# EAGLE design untitled (EAGLE 7.6.0)
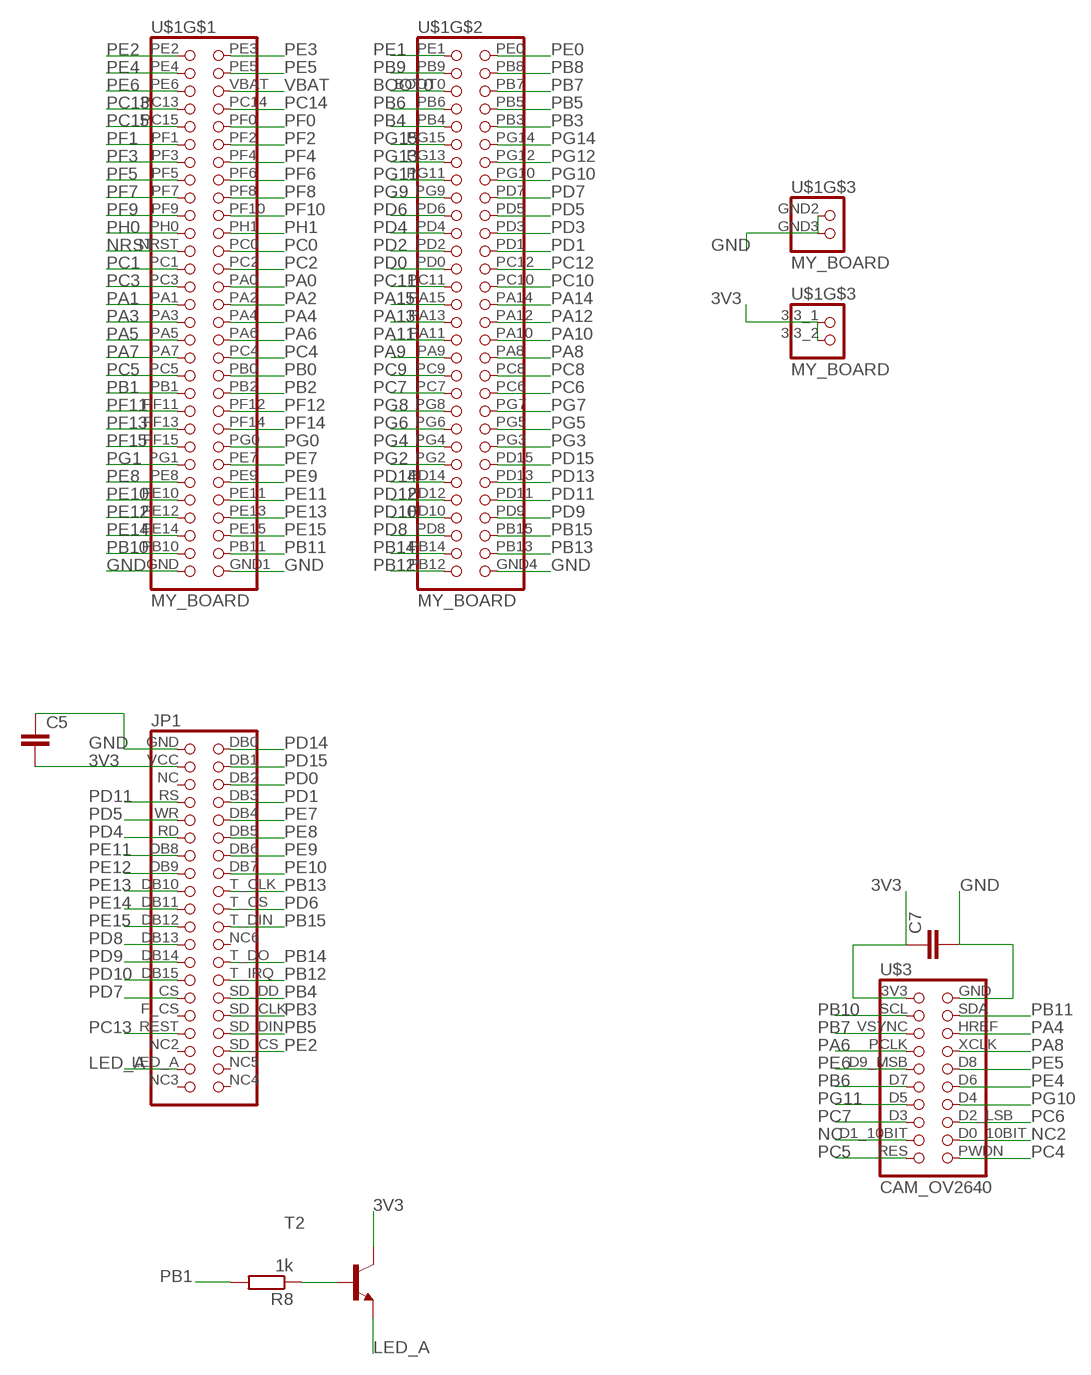
[diagram p0: schematic, sheet 1]

## Parts
C5  C-EUC1206  [C1206]
C7  C-EUC1206  [C1206]
JP1  LCD320QVBLCD320QVB  [2X20]
R8  1k  R-EU_R1206  [R1206]
T2  BC817-16-NPN-SOT23-BEC  [SOT23-BEC]
U$1  MY_BOARD  [MY_BOARD]
U$3  CAM_OV2640  [CAM_OV2640]

## Nets
3V3: C5.2 C7.1 JP1.VCC T2.C U$1.3,3_1 U$1.3,3_2 U$3.3V3
BOOT0: U$1.BOOT0
GND: C5.1 C7.2 JP1.GND U$1.GND U$1.GND1 U$1.GND2 U$1.GND3 U$1.GND4 U$3.GND
LED_A: JP1.LED_A T2.E
N$9: R8.1 T2.B
NC: U$3.D1_10BIT
NC2: U$3.D0_10BIT
NRST: U$1.NRST
PA0: U$1.PA0
PA1: U$1.PA1
PA2: U$1.PA2
PA3: U$1.PA3
PA4: U$1.PA4 U$3.HREF
PA5: U$1.PA5
PA6: U$1.PA6 U$3.PCLK
PA7: U$1.PA7
PA8: U$1.PA8 U$3.XCLK
PA9: U$1.PA9
PA10: U$1.PA10
PA11: U$1.PA11
PA12: U$1.PA12
PA13: U$1.PA13
PA14: U$1.PA14
PA15: U$1.PA15
PB0: U$1.PB0
PB1: R8.2 U$1.PB1
PB2: U$1.PB2
PB3: JP1.SD_CLK U$1.PB3
PB4: JP1.SD_DD U$1.PB4
PB5: JP1.SD_DIN U$1.PB5
PB6: U$1.PB6 U$3.D7
PB7: U$1.PB7 U$3.VSYNC
PB8: U$1.PB8
PB9: U$1.PB9
PB10: U$1.PB10 U$3.SCL
PB11: U$1.PB11 U$3.SDA
PB12: JP1.T_IRQ U$1.PB12
PB13: JP1.T_CLK U$1.PB13
PB14: JP1.T_DO U$1.PB14
PB15: JP1.T_DIN U$1.PB15
PC0: U$1.PC0
PC1: U$1.PC1
PC2: U$1.PC2
PC3: U$1.PC3
PC4: U$1.PC4 U$3.PWDN
PC5: U$1.PC5 U$3.RES
PC6: U$1.PC6 U$3.D2_LSB
PC7: U$1.PC7 U$3.D3
PC8: U$1.PC8
PC9: U$1.PC9
PC10: U$1.PC10
PC11: U$1.PC11
PC12: U$1.PC12
PC13: JP1.REST U$1.PC13
PC14: U$1.PC14
PC15: U$1.PC15
PD0: JP1.DB2 U$1.PD0
PD1: JP1.DB3 U$1.PD1
PD2: U$1.PD2
PD3: U$1.PD3
PD4: JP1.RD U$1.PD4
PD5: JP1.WR U$1.PD5
PD6: JP1.T_CS U$1.PD6
PD7: JP1.CS U$1.PD7
PD8: JP1.DB13 U$1.PD8
PD9: JP1.DB14 U$1.PD9
PD10: JP1.DB15 U$1.PD10
PD11: JP1.RS U$1.PD11
PD12: U$1.PD12
PD13: U$1.PD13
PD14: JP1.DB0 U$1.PD14
PD15: JP1.DB1 U$1.PD15
PE0: U$1.PE0
PE1: U$1.PE1
PE2: JP1.SD_CS U$1.PE2
PE3: U$1.PE3
PE4: U$1.PE4 U$3.D6
PE5: U$1.PE5 U$3.D8
PE6: U$1.PE6 U$3.D9_MSB
PE7: JP1.DB4 U$1.PE7
PE8: JP1.DB5 U$1.PE8
PE9: JP1.DB6 U$1.PE9
PE10: JP1.DB7 U$1.PE10
PE11: JP1.DB8 U$1.PE11
PE12: JP1.DB9 U$1.PE12
PE13: JP1.DB10 U$1.PE13
PE14: JP1.DB11 U$1.PE14
PE15: JP1.DB12 U$1.PE15
PF0: U$1.PF0
PF1: U$1.PF1
PF2: U$1.PF2
PF3: U$1.PF3
PF4: U$1.PF4
PF5: U$1.PF5
PF6: U$1.PF6
PF7: U$1.PF7
PF8: U$1.PF8
PF9: U$1.PF9
PF10: U$1.PF10
PF11: U$1.PF11
PF12: U$1.PF12
PF13: U$1.PF13
PF14: U$1.PF14
PF15: U$1.PF15
PG0: U$1.PG0
PG1: U$1.PG1
PG2: U$1.PG2
PG3: U$1.PG3
PG4: U$1.PG4
PG5: U$1.PG5
PG6: U$1.PG6
PG7: U$1.PG7
PG8: U$1.PG8
PG9: U$1.PG9
PG10: U$1.PG10 U$3.D4
PG11: U$1.PG11 U$3.D5
PG12: U$1.PG12
PG13: U$1.PG13
PG14: U$1.PG14
PG15: U$1.PG15
PH0: U$1.PH0
PH1: U$1.PH1
VBAT: U$1.VBAT
Unconnected: JP1.F_CS JP1.NC JP1.NC2 JP1.NC3 JP1.NC4 JP1.NC5 JP1.NC6

## Library data of the parts
C5 C7 = resistor:C-EU: CAPACITOR, European symbol
JP1 = Stworzone:LCD320QVB: LCD320 QVB
R8 = rcl:R-EU_: RESISTOR, European symbol
T2 = transistor:*-NPN-: NPN Transistror BF959 corrected 2008.03.06
U$1 = Stworzone:MY_BOARD
U$3 = Stworzone:CAM_OV2640

## Board
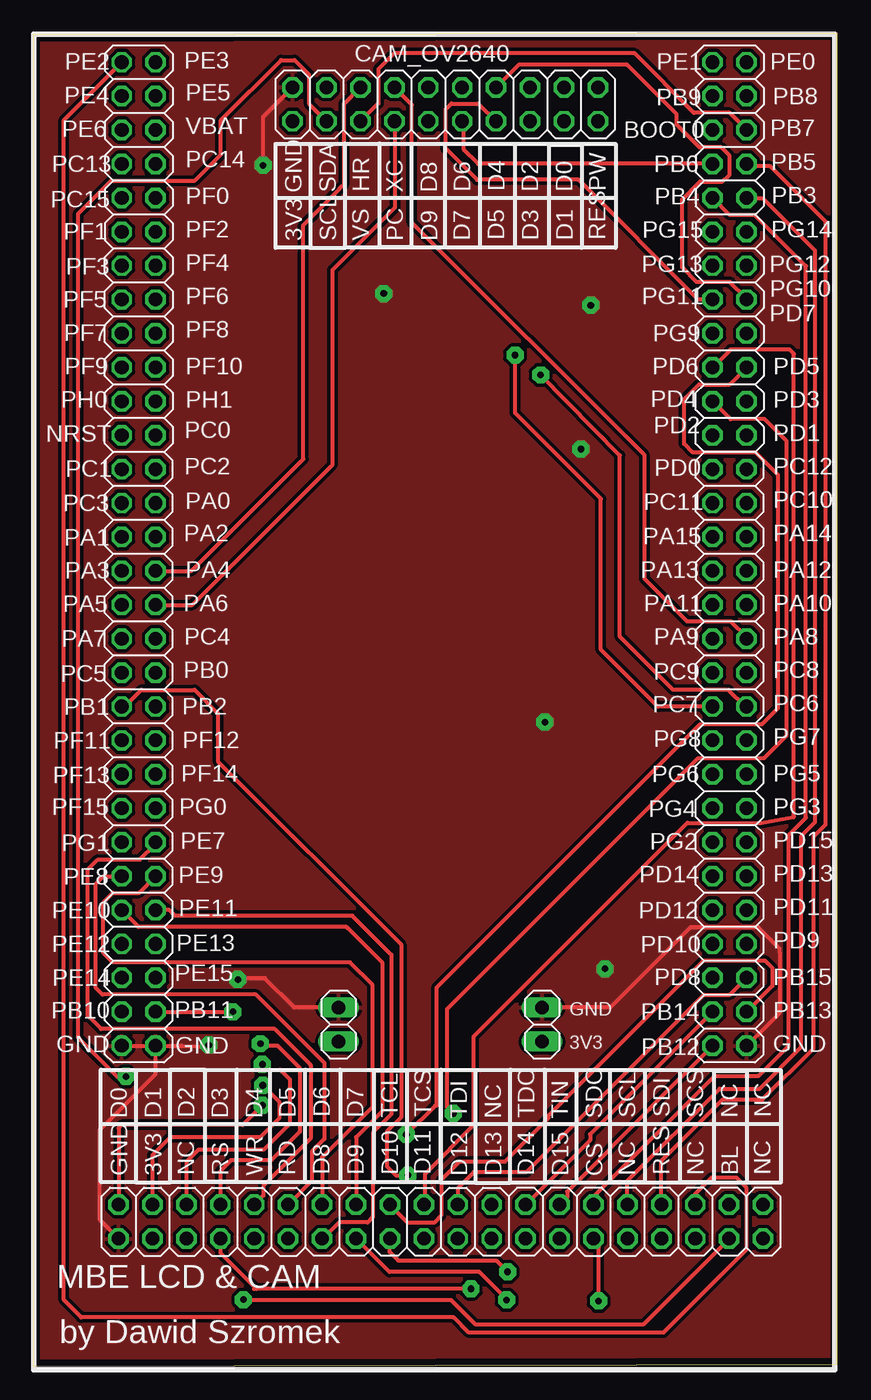
[diagram p1: board, top side]
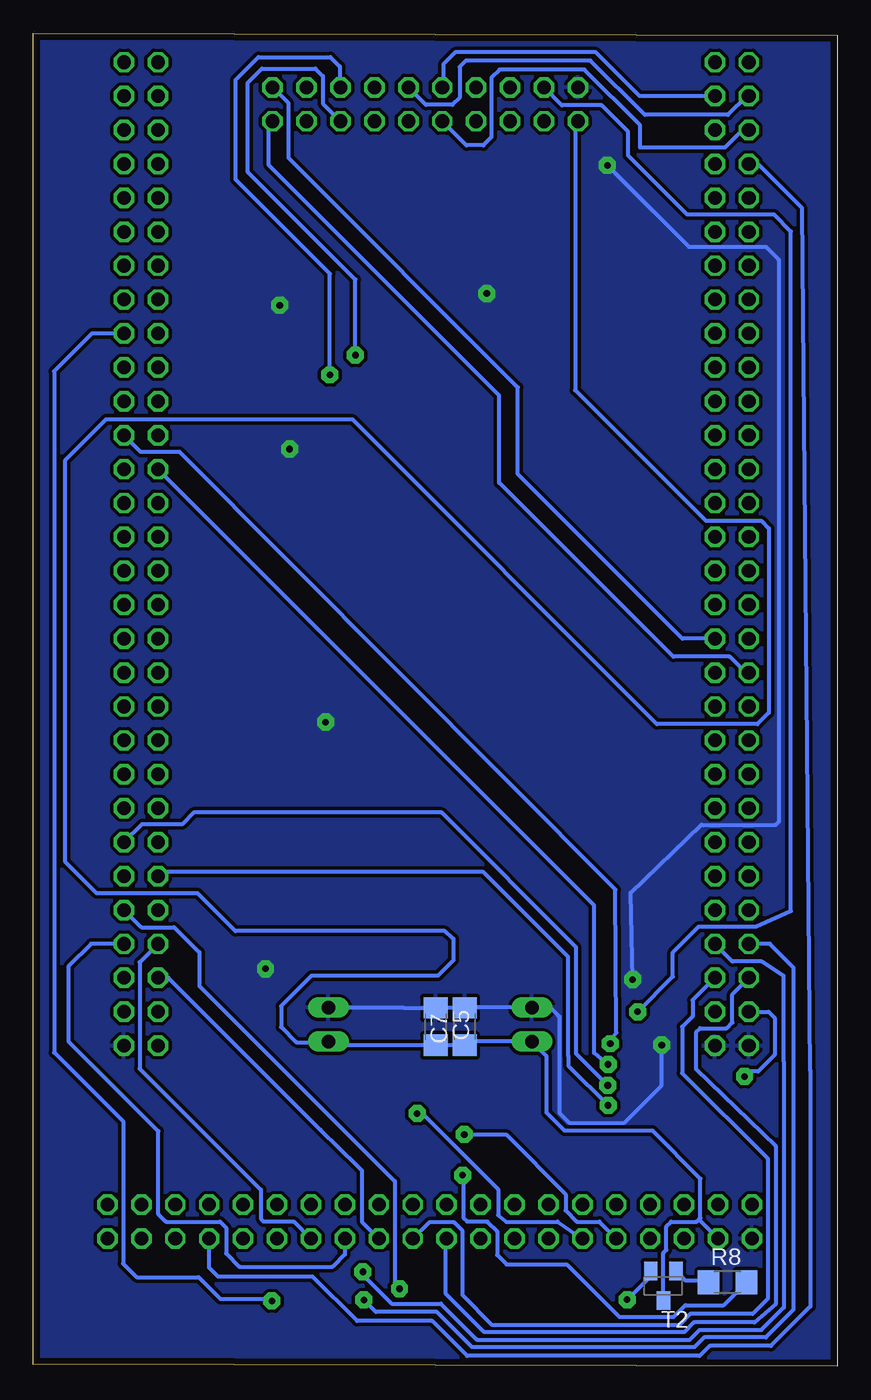
[diagram p2: board, bottom side, seen from below]

Size 60.18 x 99.82 mm. Coordinates in mm from the lower left corner, seen from the top.
Outline: 0,0 60.18,0.13 60.18,99.82 0,99.7 0,0
Copper layers (1*16): Top 0.035mm / dielectric 1.6mm / Bottom 0.035mm
Design rules "Elecrow_2-layer_PCB_eagle_rule": minimum track width 6mil, minimum drill 12mil, track to track 6mil, track to pad 6mil, pad to pad 6mil, via to via 8mil, smd to smd 0mil, copper to edge 20mil, drill to drill 10mil, minimum pad ring 6mil, minimum via ring 6mil, stop-mask expansion 0mil, vias tented up to drill 100mil, thermal gap 10mil

### Footprints (pad centres in the part's own frame; a part is rotated, then mirrored left to right if it is on the bottom)
C1206 = smd 1.6 x 1.8: 1 -1.4,0; 2 1.4,0
2X20 = drill 1.016 octagon: CS 11.43,-1.27; DB0 -24.13,1.27; DB1 -21.59,1.27; DB2 -19.05,1.27; DB3 -16.51,1.27; DB4 -13.97,1.27; DB5 -11.43,1.27; DB6 -8.89,1.27; DB7 -6.35,1.27; DB8 -8.89,-1.27; DB9 -6.35,-1.27; DB10 -3.81,-1.27; DB11 -1.27,-1.27; DB12 1.27,-1.27; DB13 3.81,-1.27; DB14 6.35,-1.27; DB15 8.89,-1.27; F_CS 13.97,-1.27; GND -24.13,-1.27; LED_A 21.59,-1.27; NC -19.05,-1.27; NC2 19.05,-1.27; NC3 24.13,-1.27; NC4 24.13,1.27; NC5 21.59,1.27; NC6 3.81,1.27; RD -11.43,-1.27; REST 16.51,-1.27; RS -16.51,-1.27; SD_CLK 13.97,1.27; SD_CS 19.05,1.27; SD_DD 11.43,1.27; SD_DIN 16.51,1.27; T_CLK -3.81,1.27; T_CS -1.27,1.27; T_DIN 1.27,1.27; T_DO 6.35,1.27; T_IRQ 8.89,1.27; VCC -21.59,-1.27; WR -13.97,-1.27
R1206 = smd 1.6 x 1.803: 1 -1.422,0; 2 1.422,0
SOT23-BEC = smd 1 x 1.4: B -0.95,-1.1; C 0,1.1; E 0.95,-1.1
MY_BOARD = drill 1.016 long: 3,3_1 12.34,-5.43; 3,3_2 27.57,-5.43; GND2 12.34,-2.89; GND3 27.57,-2.89 | drill 1.016 octagon: BOOT0 40.34,62.84; GND -3.9,-5.74; GND1 -1.36,-5.74; GND4 42.88,-5.74; NRST -3.9,39.98; PA0 -1.36,34.9; PA1 -3.9,32.36; PA2 -1.36,32.36; PA3 -3.9,29.82; PA4 -1.36,29.82; PA5 -3.9,27.28; PA6 -1.36,27.28; PA7 -3.9,24.74; PA8 42.88,24.74; PA9 40.34,24.74; PA10 42.88,27.28; PA11 40.34,27.28; PA12 42.88,29.82; PA13 40.34,29.82; PA14 42.88,32.36; PA15 40.34,32.36; PB0 -1.36,22.2; PB1 -3.9,19.66; PB2 -1.36,19.66; PB3 42.88,57.76; PB4 40.34,57.76; PB5 42.88,60.3; PB6 40.34,60.3; PB7 42.88,62.84; PB8 42.88,65.38; PB9 40.34,65.38; PB10 -3.9,-3.2; PB11 -1.36,-3.2; PB12 40.34,-5.74; PB13 42.88,-3.2; PB14 40.34,-3.2; PB15 42.88,-0.66; PC0 -1.36,39.98; PC1 -3.9,37.44; PC2 -1.36,37.44; PC3 -3.9,34.9; PC4 -1.36,24.74; PC5 -3.9,22.2; PC6 42.88,19.66; PC7 40.34,19.66; PC8 42.88,22.2; PC9 40.34,22.2; PC10 42.88,34.9; PC11 40.34,34.9; PC12 42.88,37.44; PC13 -3.9,60.3; PC14 -1.36,60.3; PC15 -3.9,57.76; PD0 40.34,37.44; PD1 42.88,39.98; PD2 40.34,39.98; PD3 42.88,42.52; PD4 40.34,42.52; PD5 42.88,45.06; PD6 40.34,45.06; PD7 42.88,47.6; PD8 40.34,-0.66; PD9 42.88,1.88; PD10 40.34,1.88; PD11 42.88,4.42; PD12 40.34,4.42; PD13 42.88,6.96; PD14 40.34,6.96; PD15 42.88,9.5; PE0 42.88,67.92; PE1 40.34,67.92; PE2 -3.9,67.92; PE3 -1.36,67.92; PE4 -3.9,65.38; PE5 -1.36,65.38; PE6 -3.9,62.84; PE7 -1.36,9.5; PE8 -3.9,6.96; PE9 -1.36,6.96; PE10 -3.9,4.42; PE11 -1.36,4.42; PE12 -3.9,1.88; PE13 -1.36,1.88; PE14 -3.9,-0.66; PE15 -1.36,-0.66; PF0 -1.36,57.76; PF1 -3.9,55.22; PF2 -1.36,55.22; PF3 -3.9,52.68; PF4 -1.36,52.68; PF5 -3.9,50.14; PF6 -1.36,50.14; PF7 -3.9,47.6; PF8 -1.36,47.6; PF9 -3.9,45.06; PF10 -1.36,45.06; PF11 -3.9,17.12; PF12 -1.36,17.12; PF13 -3.9,14.58; PF14 -1.36,14.58; PF15 -3.9,12.04; PG0 -1.36,12.04; PG1 -3.9,9.5; PG2 40.34,9.5; PG3 42.88,12.04; PG4 40.34,12.04; PG5 42.88,14.58; PG6 40.34,14.58; PG7 42.88,17.12; PG8 40.34,17.12; PG9 40.34,47.6; PG10 42.88,50.14; PG11 40.34,50.14; PG12 42.88,52.68; PG13 40.34,52.68; PG14 42.88,55.22; PG15 40.34,55.22; PH0 -3.9,42.52; PH1 -1.36,42.52; VBAT -1.36,62.84
CAM_OV2640 = drill 1.016 octagon: 3V3 -1.27,11.43; D0_10BIT 1.27,-8.89; D1_10BIT -1.27,-8.89; D2_LSB 1.27,-6.35; D3 -1.27,-6.35; D4 1.27,-3.81; D5 -1.27,-3.81; D6 1.27,-1.27; D7 -1.27,-1.27; D8 1.27,1.27; D9_MSB -1.27,1.27; GND 1.27,11.43; HREF 1.27,6.35; PCLK -1.27,3.81; PWDN 1.27,-11.43; RES -1.27,-11.43; SCL -1.27,8.89; SDA 1.27,8.89; VSYNC -1.27,6.35; XCLK 1.27,3.81

### Placement (x,y rotation side)
C5  30.05,25.43 270 bottom
C7  27.9,25.43 90 bottom
JP1  30.51,10.82 0 top
R8  8.2,6.27 0 bottom
T2  13,6.02 180 bottom
U$1  10.52,29.74 0 top
U$3  30.84,94.51 90 top

### Tracks (layer width: path | path; a pad name or v marks a point on that pad's centre or on a via)
3V3
  Bottom 0.305: U$3.3V3 19.61,93.04 19.61,73.1 9.83,63.32 5.69,63.32 5.11,62.74 5.11,48.95 5.97,48.08 13.49,48.08 36.32,70.92 54.74,70.92 57.78,67.87 57.78,37.74 55.45,35.41 47.88,35.41 45.06,32.59 29.36,32.59 28.73,32 28.73,30.4 29.9,29.24 39.37,29.24 41.63,26.97 41.63,25.4 40.49,24.26 38.14,24.26 U$1.3,3_2 37.81,24.03 C5.2 C7.1 27.62,24.31 U$1.3,3_1 21.74,23.2 21.74,18.97 20.4,17.63 13.82,17.63 10.24,14.05 10.24,11.1 | 10.24,11.1 10.24,10.87 JP1.VCC 8.94,9.55 | T2.C 13,8.48 12.78,8.71 12.78,10.46 12.42,10.82 10.52,10.82 10.24,11.1
GND  (via drill 0.5 pad 1.27)
  Top 0.305: U$1.GND U$1.GND1 | U$1.GND1 11.08,24 13.2,23.92 13.2,24.02 v13.13,24.05 | v15.32,28.96 15.19,29.06 17.32,29.06 19.53,26.85 U$1.GND2 | v17.2,89.94 17.2,93.57 U$3.GND | JP1.GND 4.98,10.95 4.98,17.7 9.16,21.88 U$1.GND1 | U$1.GND4 55.91,26.51 55.91,30.96 55.88,30.99 55.88,31.27 54.28,32.87 49.2,32.87 43.19,26.85 U$1.GND3
  Bottom 0.305: U$1.GND3 32.48,26.85 32.46,26.83 C5.1 C7.2 27.88,26.85 U$1.GND2 21.47,26.85 20.88,26.26 | 20.9,26.26 20.88,26.26 | 20.88,26.26 20.8,26.19 20.8,18.97 20.07,18.24 15.93,18.24 13.13,21.03 v13.13,24.05 | v15.32,28.96 15.47,35.46 10.16,40.54 4.6,40.54 4.34,40.79 4.34,82.85 5.31,83.82 11.07,83.82 v17.2,89.94
  other vias: 26.24,80.34 41.73,79.45 41,68.68 38.3,48.23 42.8,29.77
  pour Bottom (isolate 0.254): 0.05,99.72 60.1,99.72 60.1,0.13 0.05,0.13
  pour Top (isolate 0.254): 0.03,99.72 60.1,99.72 60.1,0.13 0.03,0.13
LED_A  (via drill 0.5 pad 1.27)
  Top 0.305: v15.72,4.98 31.27,4.95 33.07,3.15 45.69,3.15 JP1.LED_A
  Bottom 0.305: v15.72,4.98 14.04,6.66 14.04,7.17 14.01,7.17 T2.E
N$9
  Bottom 0.305: R8.1 9.94,6.4 11.34,6.4 T2.B
PA4
  Top 0.305: U$1.PA4 11.84,59.56 20.22,67.95 20.22,85.47 22.94,88.19 22.94,88.21 23.06,88.34 23.09,88.34 23.27,88.52 23.27,94.56 U$3.HREF
PA6
  Top 0.305: U$1.PA6 11.89,57.02 22.4,67.54 22.4,82.12 27.08,86.79 27.08,93.19 U$3.PCLK
PA8
  Top 0.305: U$1.PA8 53.4,54.61 52.22,55.78 48.95,55.78 45.77,58.95 45.77,68.22 28.35,85.65 28.35,94.46 U$3.XCLK
PB1  (via drill 0.5 pad 1.27)
  Top 0.305: U$1.PB1 6.83,49.4 8.08,50.65 12.06,50.65 13.82,48.9 13.82,45.29 27.53,31.57 27.53,18.64 26.47,17.58 26.47,14.96 27.13,14.3 v28.04,14.3
  Bottom 0.305: v28.04,14.3 27.99,14.25 27.99,11.13 27.71,10.85 26.29,10.85 26.26,10.82 26.19,10.82 25.45,10.08 25.45,8.33 24.74,7.62 20.24,7.62 16.31,3.68 12.24,3.68 11.35,4.57 8.48,4.57 R8.2
PB3
  Top 0.305: JP1.SD_CLK 44.48,13.87 51.38,20.78 54.38,20.78 57.51,23.9 57.51,39.73 58.52,40.74 58.52,83.57 54.66,87.43 53.47,87.43 U$1.PB3
PB4
  Top 0.305: JP1.SD_DD 41.94,12.67 51,21.74 54.31,21.74 56.54,23.98 56.54,39.78 57.84,41.07 57.84,82.4 54.03,86.21 52.15,86.21 U$1.PB4
PB5
  Top 0.305: JP1.SD_DIN 47.02,15.37 51.61,19.96 54.58,19.96 58.42,23.8 58.42,39.67 59.31,40.56 59.31,85.73 55.17,89.87 53.57,89.87 U$1.PB5
PB6
  Top 0.305: U$1.PB6 33.3,90.04 32.23,91.11 32.23,93.12 U$3.D7
PB7
  Top 0.305: U$1.PB7 53.4,92.6 52.12,93.88 49.45,93.88 45.01,98.32 27,98.32 25.83,97.16 25.83,94.59 U$3.VSYNC
PB10  (via drill 0.5 pad 1.27)
  Top 0.305: v6.93,21.69 6.25,21.69 3.35,24.59 3.35,86.31 5.84,88.8 12.09,88.8 14.05,90.75 14.05,93.32 18.54,97.82 19.56,97.82 20.62,96.75 20.62,94.56 U$3.SCL
  Bottom 0.305: U$1.PB10 5.13,26.54 4.67,26.09 4.67,23.32 5.92,22.07 6.55,22.07 v6.93,21.69
PB11  (via drill 0.5 pad 1.27)
  Top 0.305: U$1.PB11 12.19,26.54 v14.94,26.54
  Bottom 0.305: v14.94,26.54 12.29,29.18 12.29,30.99 10.36,32.92 6.07,32.92 3.45,34.09 3.45,84.99 4.72,86.26 5.82,86.26 6.25,86.26 11.23,86.26 15.65,90.68 15.65,92.46 17.63,94.44 20.6,94.44 U$3.SDA
PB12
  Top 0.305: U$1.PB12 46.15,19.3 46.15,19.25 39.95,13.06 39.95,12.65 JP1.T_IRQ
PB13
  Top 0.305: U$1.PB13 55.32,28.47 55.32,29.82 54.76,30.38 50.19,30.38 38.56,18.75 38.56,18.57 35.31,15.32 31.9,15.32 30.53,13.94 30.53,11.28 30,10.74 28.04,10.74 JP1.T_CLK
PB14
  Top 0.305: U$1.PB14 41.69,17.37 41.69,16.92 JP1.T_DO
PB15
  Top 0.305: U$1.PB15 52.13,27.81 50.19,27.81 36.91,14.53 32.97,14.53 31.78,13.34 JP1.T_DIN
PC4
  Bottom 0.305: U$1.PC4 11.58,54.48 23.9,66.8 23.9,73.3 41.07,90.47 41.07,94.59 U$3.PWDN
PC5
  Bottom 0.305: U$1.PC5 6.86,51.94 8.05,53.14 12.27,53.14 25.3,66.17 25.3,72.69 42.54,89.94 42.54,92.96 U$3.RES
PC6  (via drill 0.5 pad 1.27)
  Top 0.305: U$1.PC6 53.29,49.4 52.04,50.65 47.9,50.65 43.92,54.64 43.92,68.2 v37.97,74.24
  Bottom 0.305: v37.97,74.24 37.97,81.81 45.03,88.87 45.03,96.34 43.33,98.04 37.95,98.04 37.24,97.33 37.24,95.83 U$3.D2_LSB
PC7  (via drill 0.5 pad 1.27)
  Top 0.305: U$1.PC7 46.76,49.4 42.49,53.67 42.49,64.97 36.07,71.4 v36.07,75.72
  Bottom 0.305: v36.07,75.72 36.07,81.38 44.12,89.43 44.12,96.14 43.08,97.18 39.07,97.18 38.51,96.62 38.51,94.56 U$3.D3
PC13
  Bottom 0.305: JP1.REST 47.02,7.37 46.35,6.71 39.27,6.71 35.94,3.38 30.33,3.38 27.71,0.76 10.29,0.76 9.52,1.52 4.95,1.52 2.01,4.47 2.01,22.12 2.62,86.73 5.93,90.04 U$1.PC13
PD0  (via drill 0.5 pad 1.27)
  Top 0.305: v17.14,22.61 17.45,22.89 17.07,22.61 17.48,22.2 18.47,22.2 19.2,21.46 19.2,18.16 17.25,16.21 12.34,16.21 11.46,15.32 JP1.DB2
  Bottom 0.305: v17.14,22.61 17.14,22.58 18.19,23.44 18.19,34.51 U$1.PD0
PD1  (via drill 0.5 pad 1.27)
  Top 0.305: v16.99,24.16 17.25,24 18.29,24 19.94,22.35 19.94,17.55 17.81,15.42 14.81,15.42 14,14.61 JP1.DB3
  Bottom 0.305: v16.99,24.16 16.99,24.33 16.54,24.97 16.61,35.69 49.23,68.48 52.15,68.48 U$1.PD1
PD4  (via drill 0.5 pad 1.27)
  Top 0.305: U$1.PD4 52.2,70.92 54.76,70.92 56.39,69.29 56.39,47.22 54.71,45.54 49.78,45.54 30.95,26.71 30.95,19.42 v31.45,18.92
  Bottom 0.305: JP1.RD 20.93,10.82 24.74,10.8 25.37,11.3 25.37,13.23 31.06,18.92 v31.45,18.92
PD5  (via drill 0.5 pad 1.27)
  Top 0.305: U$1.PD5 52.13,73.53 49.83,73.53 48.72,72.42 48.72,69.09 49.38,68.43 54.08,68.43 55.75,66.75 55.75,49.28 54.56,48.08 49.94,48.08 30.18,28.32 30.18,19.51 30.07,19.51 v27.91,17.35
  Bottom 0.305: v27.91,17.35 24.79,17.35 20.32,12.88 20.32,11.66 19.48,10.82 17.81,10.82 JP1.WR
PD6
  Top 0.305: U$1.PD6 52.2,76.15 56.62,76.15 56.95,75.82 56.95,41.15 54.46,40.69 48.97,40.69 32.95,24.67 32.95,18.02 29.31,14.38 29.31,12.17 JP1.T_CS
PD7  (via drill 0.5 pad 1.27)
  Top 0.305: v42.32,4.88 42.32,9.17 JP1.CS
  Bottom 0.305: U$1.PD7 55.8,77.34 58.62,74.52 58.62,23.5 53.47,18.34 53.47,7.67 52.45,6.65 47.8,6.65 46.18,5.03 42.47,5.03 v42.32,4.88
PD8
  Bottom 0.305: U$1.PD8 50.06,29.08 38.68,17.7 35.92,14.99 35.59,14.66 35.59,10.82 JP1.DB13
PD9
  Bottom 0.305: U$1.PD9 55.85,31.62 57.56,29.92 57.56,24.33 50.83,17.6 50.83,11.38 50.27,10.82 46.2,10.82 45.75,10.36 45.75,8.43 44.75,7.44 37.77,7.44 36.86,8.36 JP1.DB14
PD10
  Bottom 0.305: U$1.PD10 50.75,31.52 50.95,31.52 52.22,30.25 52.22,22.28 43.15,13.21 43.15,11.05 42.95,10.85 40.69,10.85 JP1.DB15
PD11  (via drill 0.5 pad 1.27)
  Top 0.305: v32.77,5.79 16.69,5.79 | 16.69,5.79 16.51,5.79 | JP1.RS 14,8.48 16.69,5.79
  Bottom 0.305: U$1.PD11 52.1,32.87 49.63,32.87 47.75,30.99 47.75,28.47 33.12,13.84 33.12,6.15 v32.77,5.79
PD14  (via drill 0.5 pad 1.27)
  Top 0.305: v17.14,19.53 15.67,18.06 6.6,18.06 6.38,17.83 JP1.DB0
  Bottom 0.305: U$1.PD14 50.55,37.01 26.49,37.01 20.14,30.66 20.14,23.65 20.12,23.22 20.12,22.5 v17.14,19.53
PD15  (via drill 0.5 pad 1.27)
  Top 0.305: v17.17,21.03 18.39,19.81 18.39,18.54 16.97,17.12 10.24,17.12 8.92,15.8 JP1.DB1
  Bottom 0.305: U$1.PD15 52.05,40.59 49.05,40.59 48.18,41.45 29.62,41.45 19.53,31.37 19.53,23.39 v17.17,21.03
PE2
  Top 0.305: JP1.SD_CS 49.56,12.9 50.77,14.12 52.63,14.12 53.37,13.39 53.37,8.71 47.17,2.51 32.61,2.51 31.47,3.66 3.58,3.66 2.29,4.95 2.29,93.33 U$1.PE2
PE4
  Bottom 0.305: U$1.PE4 6.78,95.12 8.18,93.73 14.4,93.73 18.47,97.79 27.79,97.79 28.27,97.31 28.27,95 28.8,94.46 30.78,94.46 U$3.D6
PE5
  Bottom 0.305: U$3.D8 29.49,95.86 29.49,97.51 28.6,98.4 18.06,98.4 14.78,95.12 U$1.PE5
PE6
  Bottom 0.305: U$1.PE6 7.09,92.58 8.41,91.26 14.76,91.26 14.76,92.94 18.92,97.1 25.27,97.1 25.88,96.49 25.88,92.05 26.49,91.44 27.76,91.44 U$3.D9_MSB
PE7
  Top 0.305: U$1.PE7 9.16,39.13 7.98,37.95 4.83,37.95 4.06,37.19 4.06,26.26 5.08,25.25 18.06,25.25 20.75,22.56 20.75,17.04 17.22,13.51 17.22,12.78 JP1.DB4
PE8
  Top 0.305: U$1.PE8 6.59,36.68 5.23,36.68 4.67,36.12 4.67,28.32 5.16,27.84 16.66,27.84 21.79,22.71 21.79,17.02 20.85,16.08 20.85,13.87 JP1.DB5
PE9
  Top 0.305: 9.83,30.25 5.94,30.25 5.23,30.96 5.23,34.75 5.94,35.46 7.91,35.46 U$1.PE9 | 9.86,30.23 9.83,30.25 | 9.83,30.25 23.7,30.25 25.4,28.55 25.4,19.43 21.62,15.65 JP1.DB6
PE10
  Top 0.305: U$1.PE10 7.89,32.89 23.44,32.89 23.52,32.82 23.55,32.82 26.11,30.25 26.11,19.1 24.16,17.15 JP1.DB7
PE11
  Top 0.305: U$1.PE11 10.19,34.16 10.62,33.73 23.88,33.73 26.8,30.81 26.8,18.87 25.43,17.5 25.43,11.18 25.02,10.77 22.89,10.77 21.67,9.55 JP1.DB8 | U$1.PE11
PE12  (via drill 0.5 pad 1.27)
  Top 0.305: v35.43,4.95 35.43,5 33.38,7.06 26.64,7.06 JP1.DB9
  Bottom 0.305: U$1.PE12 5.03,31.62 3.25,29.85 3.25,4.24 5.33,2.16 9.96,2.16 10.69,1.42 27.33,1.42 29.97,4.06 34.54,4.06 v35.43,4.95
PE13  (via drill 0.5 pad 1.27)
  Top 0.305: v35.51,7.06 34.65,7.92 27.3,7.92 26.67,8.56 26.67,9.53 JP1.DB10
  Bottom 0.305: U$1.PE13 7.83,30.3 5.64,30.3 4.01,29.24 3.99,22.78 3.99,4.39 5.66,2.72 10.29,2.72 11.02,1.98 26.97,1.98 29.67,4.67 33.35,4.67 35.51,6.83 v35.51,7.06
PE14
  Bottom 0.305: U$1.PE14 7.85,27.85 7.85,25.73 8.28,25.3 10.26,25.3 10.57,24.99 10.57,22.25 4.6,16.48 4.6,4.65 6.17,3.28 10.72,3.28 11.46,2.54 26.42,2.54 29.29,5.41 29.29,9.5 JP1.DB11
PE15
  Bottom 0.305: U$1.PE15 10.82,27.42 10.82,26.21 11.61,25.43 11.61,21.95 5.21,15.54 5.21,5.03 6.32,3.91 11,3.91 11.84,3.07 25.81,3.07 28.04,5.31 28.04,10.13 28.68,10.77 30.56,10.77 JP1.DB12
PG10
  Top 0.305: U$1.PG10 53.4,79.95 52.15,81.2 49.66,81.2 48.56,82.3 48.56,87.38 49.91,88.72 51.59,88.72 52.12,89.26 52.12,90.65 51.49,91.29 49.86,91.29 48.16,92.99 48.16,93.75 44.45,97.46 36.32,97.46 U$3.D4
PG11
  Top 0.305: U$1.PG11 49.78,79.88 40.82,88.85 33.22,88.85 30.86,91.21 30.86,94.13 31.29,94.56 33.32,94.56 U$3.D5

### Text on the board
tNames: PE2 | PE3 | CAM_OV2640 | PE1 | PE0 | PE4 | PE5 | PB9 | PB8 | PE6 | VBAT | BOOT0 | PB7 | PC13 | PC14 | PB6 | PB5 | GND | SDA | HR | XC | D8 | D6 | D4 | D2 | D0 | PW | PF0 | PB4 | PB3 | PC15 | PF1 | PF2 | 3V3 | SCL | VS | PC | D9 | D7 | D5 | D3 | D1 | RES | PG15 | PG14 | PF4 | PG13 | PG12 | PF3 | PG10 | PF5 | PF6 | PG11 | PD7 | PF8 | PF7 | PG9 | PF9 | PF10 | PD6 | PD5 | PD4 | PH0 | PH1 | PD3 | PD2 | NRST | PC0 | PD1 | PC1 | PC2 | PD0 | PC12 | PC3 | PA0 | PC11 | PC10 | PA1 | PA2 | PA15 | PA14 | PA3 | PA4 | PA13 | PA12 | PA5 | PA6 | PA11 | PA10 | PA7 | PC4 | PA9 | PA8 | PC5 | PB0 | PC9 | PC8 | PB2 | PC7 | PC6 | PB1 | PF11 | PF12 | PG8 | PG7 | PF13 | PF14 | PG6 | PG5 | PF15 | PG0 | PG4 | PG3 | PG1 | PE7 | PG2 | PD15 | PE8 | PE9 | PD14 | PD13 | PE10 | PE11 | PD12 | PD11 | PE12 | PE13 | PD10 | PD9 | PE15 | PE14 | PD8 | PB15 | PB10 | PB11 | GND | PB14 | PB13 | GND | GND | 3V3 | PB12 | GND | D0 | D1 | D2 | D3 | D4 | D5 | D6 | D7 | TCL | TCS | TDI | NC | TDO | TIN | SDO | SCL | SDI | SCS | NC | NC | GND | 3V3 | NC | RS | WR | RD | D8 | D9 | D10 | D11 | D12 | D13 | D14 | D15 | CS | NC | RES | NC | BL | NC | MBE LCD & CAM | by Dawid Szromek